# Altium schematic sheet CONN.SchDoc
size A3; SheetNumber: 1; SheetTotal: 5
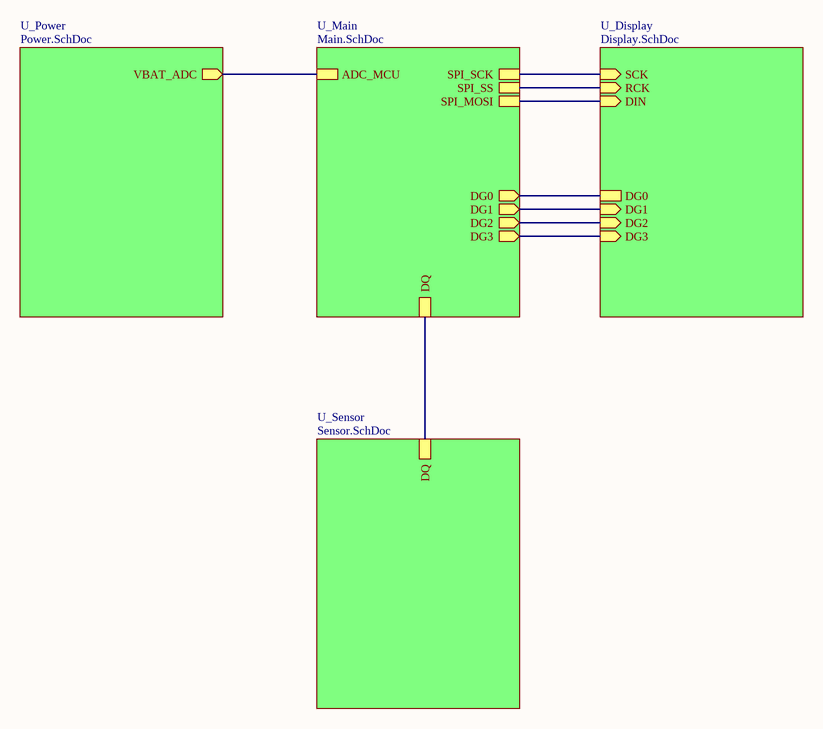
[diagram p0: CONN.SchDoc]

## Sub-sheets
U_Display = Display.SchDoc: DIN (in), RCK (in), SCK (in), DG0, DG1 (in), DG2 (in), DG3 (in)
U_Main = Main.SchDoc: DQ, DG0 (out), DG1 (out), DG2 (out), DG3 (out), ADC_MCU, SPI_SCK, SPI_MOSI, SPI_SS
U_Power = Power.SchDoc: VBAT_ADC (out)
U_Sensor = Sensor.SchDoc: DQ

## Nets
(unnamed): sheet U_Display/DIN, sheet U_Main/SPI_MOSI
(unnamed): sheet U_Display/RCK, sheet U_Main/SPI_SS
(unnamed): sheet U_Display/SCK, sheet U_Main/SPI_SCK
(unnamed): sheet U_Display/DG0, sheet U_Main/DG0
(unnamed): sheet U_Display/DG1, sheet U_Main/DG1
(unnamed): sheet U_Display/DG2, sheet U_Main/DG2
(unnamed): sheet U_Display/DG3, sheet U_Main/DG3
(unnamed): sheet U_Power/VBAT_ADC, sheet U_Main/ADC_MCU
(unnamed): sheet U_Main/DQ, sheet U_Sensor/DQ